# EAGLE design SparkFun_PIR_Breakout (EAGLE 9.6.0)
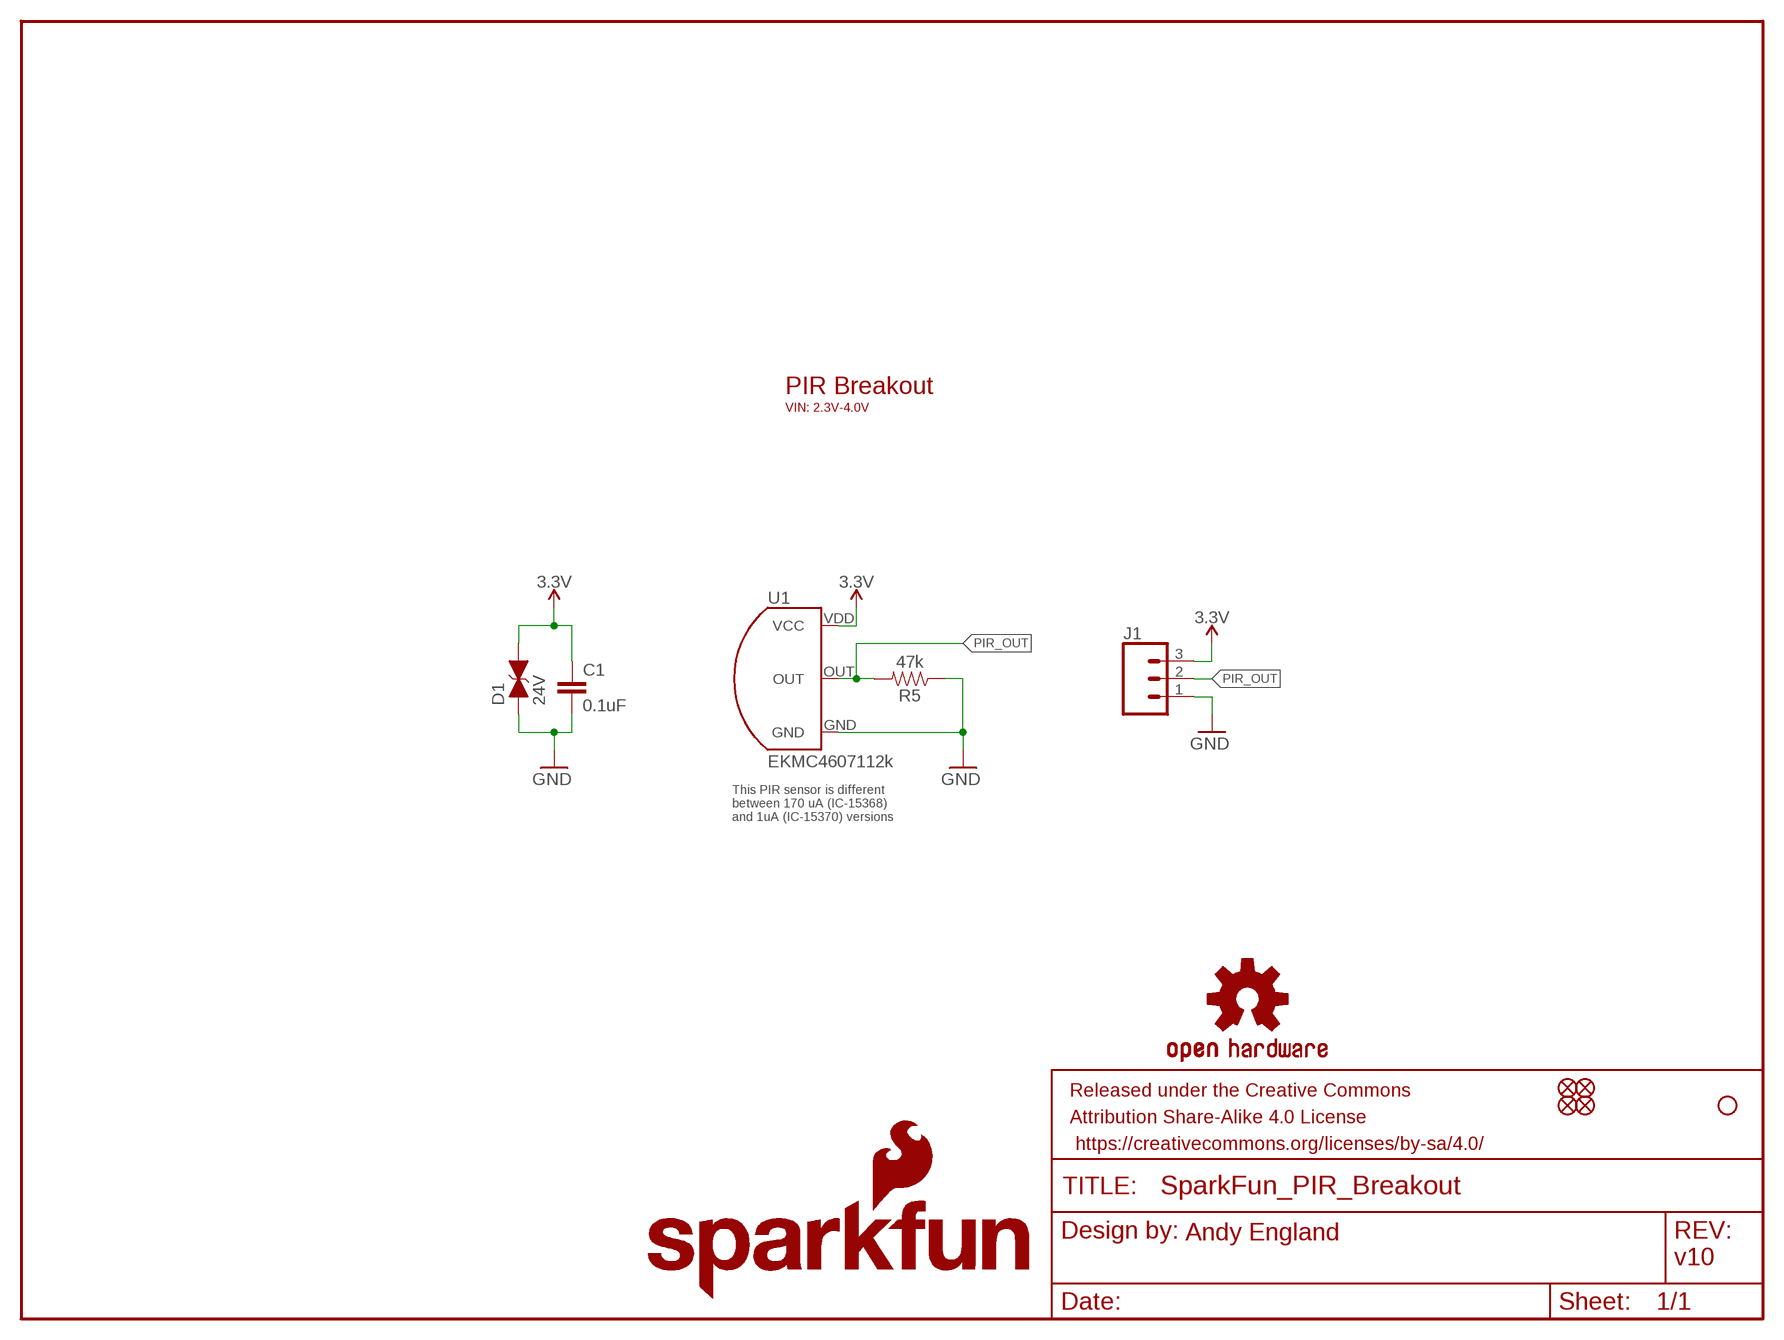
[diagram p0: schematic, sheet 1]

## Parts
C1  0.1uF  0.1UF-0603-25V-(+80/-20%)  [0603]
D1  24V  DIODE_TVS  [0603]
FRAME1  FRAME-LETTER  [CREATIVE_COMMONS]
H1  STAND-OFF  [STAND-OFF]
J1  CONN_031X03_NO_SILK  [1X03_NO_SILK]
JP2  FIDUCIALUFIDUCIAL  [MICRO-FIDUCIAL]
JP6  FIDUCIALUFIDUCIAL  [MICRO-FIDUCIAL]
JP8  FIDUCIALUFIDUCIAL  [MICRO-FIDUCIAL]
JP9  FIDUCIALUFIDUCIAL  [MICRO-FIDUCIAL]
LOGO1  OSHW-LOGOMINI  [OSHW-LOGO-MINI]
LOGO3  SFE_LOGO_NAME_FLAME.1_INCH  [SFE_LOGO_NAME_FLAME_.1]
LOGO4  SFE_LOGO_FLAME.1_INCH  [SFE_LOGO_FLAME_.1]
R5  47k  47KOHM-0603-1/10W-1%  [0603]
U1  EKMC4607112k  PIR_EKM4607112K  [TO-3]

## Nets
3.3V: C1.1 D1.2(C) J1.3 U1.VDD(VCC)
GND: C1.2 D1.1(A) J1.1 R5.1 U1.GND
PIR_OUT: J1.2 R5.2 U1.OUT

## Notes on the sheet
- PIR Breakout
- VIN: 2.3V-4.0V
- This PIR sensor is different 
  between 170 uA (IC-15368)
  and 1uA (IC-15370) versions
- Andy England
- v10

## Library data of the parts
C1 = SparkFun-Capacitors:0.1UF: 0.1µF ceramic capacitors A capacitor is a passive two-terminal electrical component used to store electrical energy temporarily in an electric field.; PROD_ID: CAP-00810
D1 = SparkFun-DiscreteSemi:DIODE_TVS; PROD_ID: DIO-14502
FRAME1 = SparkFun-Aesthetics:FRAME-LETTER: Schematic Frame - Letter Standard 8.5x11 US Letter frame
H1 = SparkFun-Hardware:STAND-OFF: Stand Off Drill holes for mechanically mounting via screws, standoffs, etc. Note: Use the keepout ring to avoid running the screw head into surrounding components. Variant Overviews STAND-OFF - Mechanical footprint for a #4 phillips button head screw. STAND-OFF-TIGHT - Mechanical footprint for a #4 phillips button head screw, Example SparkFun Products Screw - Phillips Head (1/4", 4-40, 10 pack) <https://www.sparkfun.com/products/10453> (PRT-10453) Screw - Phillips Head (1/2", 4-40, 10 pack) <https://www.sparkfun.com/products/10452> (PRT-10452) Screw - Phillips Head (3/4", 4-40, 10 pack) <https://www.sparkfun.com/products/10451> (PRT-10451) Screw - Phillips Head (1", 4-40, 10 pack) <https://www.sparkfun.com/products/10450> (PRT-10450)
J1 = SparkFun-Connectors:CONN_03: Multi connection point. Often used as Generic Header-pin footprint for 0.1 inch spaced/style header connections On any of the 0.1 inch spaced packages, you can populate with these: Break Away Headers - Straight <https://www.sparkfun.com/products/116> (PRT-00116) Break Away Male Headers - Right Angle <https://www.sparkfun.com/products/553> (PRT-00553) Female Headers <https://www.sparkfun.com/products/115> (PRT-00115) Break Away Headers - Machine Pin <https://www.sparkfun.com/products/117> (PRT-00117) Break Away Female Headers - Swiss Machine Pin <https://www.sparkfun.com/products/743> (PRT-00743) Stackable Header - 3 Pin (Female, 0.1") <https://www.sparkfun.com/products/13875> (PRT-13875) For SCREWTERMINALS and SPRING TERMINALS visit here: Screw Terimnals on SparkFun.com <https://www.sparkfun.com/search/results?term=Screw+Terminals> (5mm/3.5mm/2.54mm spacing) This device is also useful as a general connection point to wire up your design to another part of your project. Our various solder wires solder well into these plated through hole pads. Hook-Up Wire - Assortment (Stranded, 22 AWG) <https://www.sparkfun.com/products/11375> (PRT-11375) Hook-Up Wire - Assortment (Solid Core, 22 AWG) <https://www.sparkfun.com/products/11367> (PRT-11367) View the entire wire category on our website here <https://www.sparkfun.com/categories/141> Special notes: Molex polarized connector foot print use with SKU : PRT-08232 with associated crimp pins and housings.
JP2 JP6 JP8 JP9 = SparkFun:FIDUCIAL: Fiducial Alignment Points Various fiducial points for machine vision alignment.
LOGO1 = SparkFun-Aesthetics:OSHW-LOGO: Open-Source Hardware (OSHW) Logo This logo indicates the piece of hardware it is found on incorporates a OSHW license and/or adheres to the definition of open source hardware found here: http://freedomdefined.org/OSHW
LOGO3 = SparkFun-Aesthetics:SFE_LOGO_NAME_FLAME: SparkFun Font Logo w/ Flame This is the SparkFun full logo. The logo on the schematic will always be the same size; the package variant is the height of the flame part of the logo. Default layer for the logo on the board is tSilk.
LOGO4 = SparkFun-Aesthetics:SFE_LOGO_FLAME: SparkFun Flame Logo This is the SparkFun flame logo. The logo on the schematic will always be the same size; the package variant is the height of the flame. Default layer for the logo on the board is tSilk.
R5 = SparkFun-Resistors:47KOHM: 47kΩ resistor A resistor is a passive two-terminal electrical component that implements electrical resistance as a circuit element. Resistors act to reduce current flow, and, at the same time, act to lower voltage levels within circuits. - Wikipedia; PROD_ID: RES-07871
U1 = SparkFun-Sensors:PIR_EKM: Panasonic EKMCX607112 PIR Sensor The low-power series of PIR sensors from Panasonic come in a 170 uA (4607) and 1 uA (1607) version.; PROD_ID: IC-15368

## Board
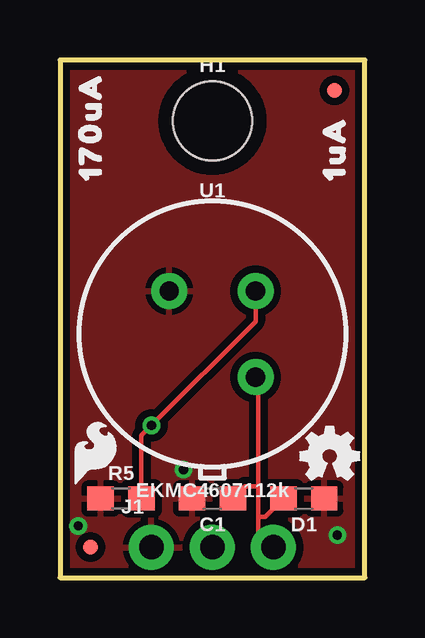
[diagram p1: board, top side]
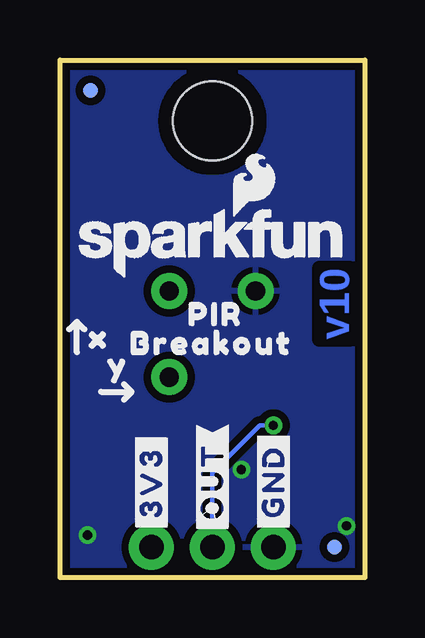
[diagram p2: board, bottom side, seen from below]

Size 12.7 x 21.59 mm. Coordinates in mm from the lower left corner, seen from the top.
Outline: 0,0 12.7,0 12.7,21.59 0,21.59 0,0
Copper layers (1*16): Top 0.035mm / dielectric 1.5mm / Bottom 0.035mm
Design rules "SparkFun-2-layer-TIGHT": minimum track width 7mil, minimum drill 15mil, track to track 7mil, track to pad 7mil, pad to pad 7mil, via to via 7mil, smd to smd 7mil, copper to edge 7mil, drill to drill 7mil, minimum pad ring 7mil, minimum via ring 7mil, stop-mask expansion 4mil, vias tented up to drill 25mil, thermal gap 10mil

### Footprints (pad centres in the part's own frame; a part is rotated, then mirrored left to right if it is on the bottom)
0603 = smd 1.1 x 1: 1 -0.85,0; 2 0.85,0
STAND-OFF = hole 3.302: 0,0
1X03_NO_SILK = drill 1.016 pad 1.88: 1 0,0; 2 2.54,0; 3 5.08,0
MICRO-FIDUCIAL = smd 0.635 x 0.635: 1 0,0
TO-3 = drill 0.8 pad 1.5: GND -1.796,1.796; OUT 1.796,1.796; VDD 1.796,-1.796

### Placement (x,y rotation side)
C1  6.35,3.3 180 top
D1  10.16,3.3 180 top
FRAME1  -19.05,-8.89 0 top  (outside the outline)
H1  6.35,19.05 0 top
J1  3.81,1.27 0 top
JP2  11.43,20.32 0 bottom
JP6  1.27,1.27 0 bottom
JP8  1.27,1.27 0 top
JP9  11.43,20.32 0 top
LOGO1  11.24,5.08 0 top
LOGO3  6.35,13.97 0 bottom
LOGO4  1.46,5.21 0 top
R5  2.54,3.3 0 top
U1  6.35,10.16 0 top
U$1  [#3V3#0]  8.89,1.78 90 bottom
U$2  [170UA0]  1.27,15.88 90 top
U$3  [#GND#0]  3.81,1.78 90 bottom
U$9  [1UA0]  11.43,15.88 90 top
U$11  [#OUT#0]  6.35,1.71 90 bottom
U$12  [BREAKOUT0]  10.48,9.78 0 bottom
U$13  [PIR0]  8.06,10.99 0 bottom
U$14  [X0]  12.19,10.03 0 bottom
U$16  [Y0]  11.43,8.89 0 bottom

### Tracks (layer width: path | path; a pad name or v marks a point on that pad's centre or on a via)
3.3V
  Top 0.178: U1.VDD 8.26,8.26 8.26,3.81 | J1.3 8.26,1.91 8.26,2.54 | 8.26,2.54 8.26,3.81 | C1.1 7.71,3.81 8.26,3.81 | D1.2 8.55,2.54 8.26,2.54
GND  (via drill 0.38)
  other vias: 11.56,1.78 5.14,4.51 0.76,2.16
  pour Top (isolate 0.305): 0,0 0,21.59 12.7,21.59 12.7,0
  pour Bottom (isolate 0.305): 0,0 12.7,0 12.7,21.59 0,21.59
PIR_OUT  (via drill 0.38)
  Top 0.178: U1.OUT 8.15,10.69 v3.81,6.35 3.39,5.93 R5.2
  Bottom 0.178: J1.2 6.35,4.38 4.38,6.35 v3.81,6.35

### Text on the board
Bottom: v10
Measures: Units in Inches
tDocu: Andy England